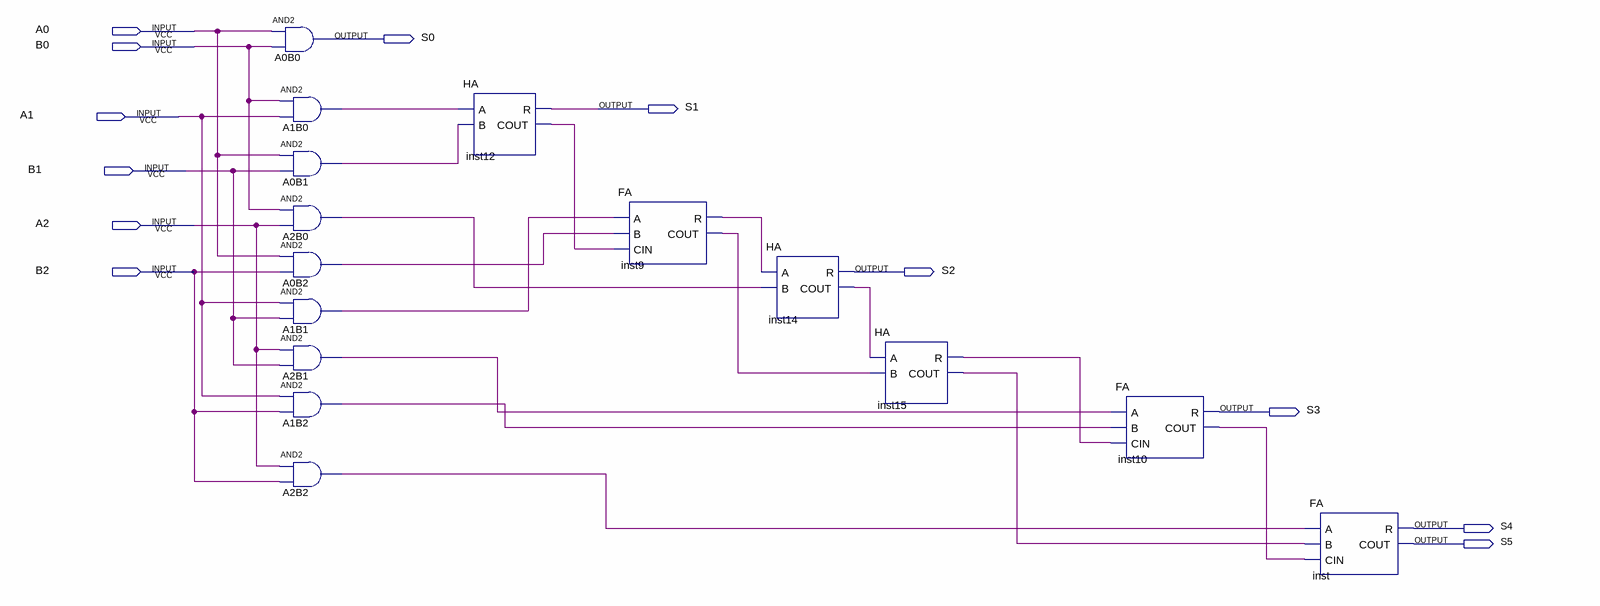
[diagram p0: schematic sheet]
// Quartus schematic MULTIPLICADOR.bdf as structural Verilog: 15 symbols, 12 pins
module MULTIPLICADOR (
  input  A0,
  input  B0,
  input  A1,
  input  B1,
  input  A2,
  input  B2,
  output S0,
  output S1,
  output S2,
  output S3,
  output S4,
  output S5
);

  wire A0B1_out, A0B2_out, A1B0_out, A1B1_out, A1B2_out, A2B0_out, A2B1_out, A2B2_out, inst9_cout, inst9_r,
       inst10_cout, inst12_cout, inst14_cout, inst15_cout, inst15_r;

  and A0B0 (S0, A0, B0);
  and A1B0 (A1B0_out, B0, A1);
  and A0B1 (A0B1_out, A0, B1);
  and A2B0 (A2B0_out, B0, A2);
  and A0B2 (A0B2_out, A0, B2);
  and A1B1 (A1B1_out, A1, B1);
  and A2B1 (A2B1_out, A2, B1);
  and A1B2 (A1B2_out, A1, B2);
  and A2B2 (A2B2_out, A2, B2);
  HA inst12 (.A(A1B0_out), .B(A0B1_out), .R(S1), .COUT(inst12_cout));
  FA inst9 (.A(A1B1_out), .B(A0B2_out), .CIN(inst12_cout), .R(inst9_r), .COUT(inst9_cout));
  HA inst14 (.A(inst9_r), .B(A2B0_out), .R(S2), .COUT(inst14_cout));
  HA inst15 (.A(inst14_cout), .B(inst9_cout), .R(inst15_r), .COUT(inst15_cout));
  FA inst10 (.A(A2B1_out), .B(A1B2_out), .CIN(inst15_r), .R(S3), .COUT(inst10_cout));
  FA inst (.A(A2B2_out), .B(inst15_cout), .CIN(inst10_cout), .R(S4), .COUT(S5));
endmodule
